# Altium schematic sheet Switches.SchDoc
size A4
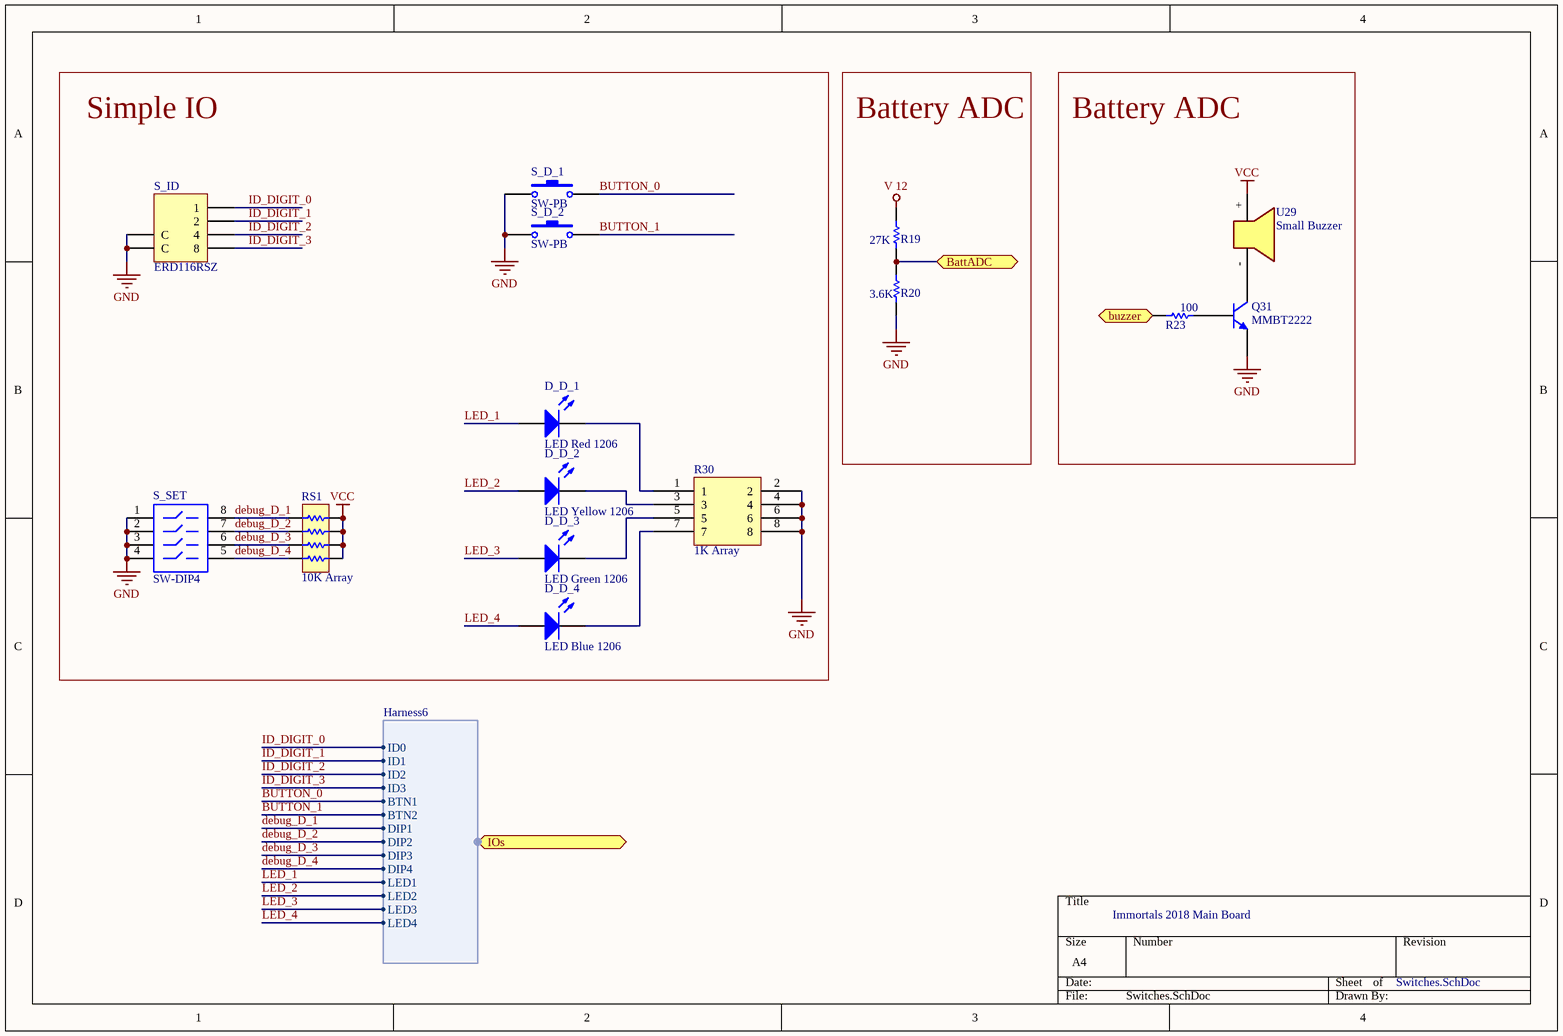
[diagram p0: Switches.SchDoc]

## Parts
D_D_1  LED Red 1206  [3.2X1.6X1.1 - RED]
D_D_2  LED Yellow 1206  [3.2X1.6X1.1 - YELLOW]
D_D_3  LED Green 1206  [3.2X1.6X1.1 - GREEN]
D_D_4  LED Blue 1206  [3.2X1.6X1.1 - BLUE]
Q31  MMBT2222  [SOT23]
R19  value 27K  [R0603]  (hidden comment: Res 27K 0603)
R20  value 3.6K  [R0603]  (hidden comment: Res 3.6K 0603)
R23  value 100  [R0603]  (hidden comment: Res 100 0603)
R30  1K Array  [RES-0603x4]
RS1  10K Array  [RES-4B]
S_D_1  SW-PB  [SPST-2]
S_D_2  SW-PB  [SPST-2]
S_ID  ERD116RSZ  [ERD116RSZ]
S_SET  SW-DIP4  [DIP-8-SW]
U29  Small Buzzer  [my_BUZZER]

## Blocks framed on the sheet
Simple IO: D_D_1-D_D_4 R30 RS1 S_D_1 S_D_2 S_ID S_SET
Battery ADC: R19 R20
Battery ADC: Q31 R23 U29

## Ports
BattADC, buzzer, IOs (harness Harness6)

## Harnesses
Harness6: ID0, ID1, ID2, ID3, BTN1, BTN2, DIP1, DIP2, DIP3, DIP4, LED1, LED2, LED3, LED4

## Nets
GND: Q31.2(E) R20.1 R30.2 R30.4 R30.6 R30.8 S_D_1.1 S_D_2.1 S_ID.2(C) S_ID.5(C) S_SET.1 S_SET.2 S_SET.3 S_SET.4
V 12: R19.2
VCC: RS1.1 RS1.3 RS1.5 RS1.7 U29.+
BattADC: R19.1 R20.2 ; port BattADC
BUTTON_0: S_D_1.2 ; port IOs.BTN1
BUTTON_1: S_D_2.2 ; port IOs.BTN2
buzzer: R23.2 ; port buzzer
debug_D_1: RS1.8 S_SET.8 ; port IOs.DIP1
debug_D_2: RS1.6 S_SET.7 ; port IOs.DIP2
debug_D_3: RS1.4 S_SET.6 ; port IOs.DIP3
debug_D_4: RS1.2 S_SET.5 ; port IOs.DIP4
ID_DIGIT_0: S_ID.1 ; port IOs.ID0
ID_DIGIT_1: S_ID.4(2) ; port IOs.ID1
ID_DIGIT_2: S_ID.3(4) ; port IOs.ID2
ID_DIGIT_3: S_ID.6(8) ; port IOs.ID3
LED_1: D_D_1.1(A) ; port IOs.LED1
LED_2: D_D_2.1(A) ; port IOs.LED2
LED_3: D_D_3.1(A) ; port IOs.LED3
LED_4: D_D_4.1(A) ; port IOs.LED4
NetD_D_1_2: D_D_1.2(K) R30.1
NetD_D_2_2: D_D_2.2(K) R30.3
NetD_D_3_2: D_D_3.2(K) R30.5
NetD_D_4_2: D_D_4.2(K) R30.7
NetQ31_1: Q31.1(B) R23.1
NetQ31_3: Q31.3(C) U29.-

## Notes on the sheet
- Immortals 2018 Main Board

## Library data of the parts
D_D_1-D_D_4 = LED2: Typical RED, GREEN, YELLOW, AMBER GaAs LED; Published: 8-Jun-2000; LatestRevisionDate: 17-Jul-2002; LatestRevisionNote: Re-released for DXP Platform.; PackageDocument: Feb-2002; PackageReference: 3.2X1.6X1.1; Publisher: Altium Limited
Q31 = MMBT2222ALT1: Transistor NPN Silicon,SMD; Value: MMBT3904; Published: 29-Sep-2000; LatestRevisionDate: 17-Jul-2002; LatestRevisionNote: Re-released for DXP Platform.; DatasheetVersion: 1996; PackageVersion: 1997; PackageReference: 318-08; Publisher: Altium Limited; PackageDescription: SOT-23; 3 Leads; Body 3.0 x 2.6 mm, inc. leads (LxW max); ComponentLink1Description: Manufacturer Link; ComponentLink1URL: http://www.onsemi.com/site/products/landing?taxonomyID=194; ComponentLink2Description: Datasheet; ComponentLink2URL: http://www.onsemi.com/pub/Collateral/MMBT2222LT1-D.PDF
R19 R20 R23 = R0603: Res 0603; Part Field 1: 3144
R30 = RES 0603x4: Array resistors; Value: 1K
RS1 = Resister Array: Resistor Array ,SMD
S_D_1 S_D_2 = SW-PB: Switch; Value: Mini push button; Published: 24-Mar-1999; LatestRevisionDate: 17-Jul-2002; LatestRevisionNote: Re-released for DXP Platform.; PackageReference: SPST-2; Publisher: Altium Limited
S_ID = Rotary Switch: Value: ERD116RSZ
S_SET = SW-DIP4: DIP Switch; Published: 24-Mar-1999; LatestRevisionDate: 17-Jul-2002; LatestRevisionNote: Re-released for DXP Platform.; PackageReference: DIP-8; Publisher: Altium Limited
U29 = my_Buzzer